# Altium schematic sheet tinyarduinoschematic.SchDoc: Arduino Nanite
size A4; Date: 9/1/2017; DrawnBy: Kartik Deshpande; Engineer: Kartik Deshpande; DocumentNumber: 1; Revision: 1.0; SheetNumber: 1; SheetTotal: 1; DocumentName: Adruino Nanite; ProjectName: Arduino Nanite
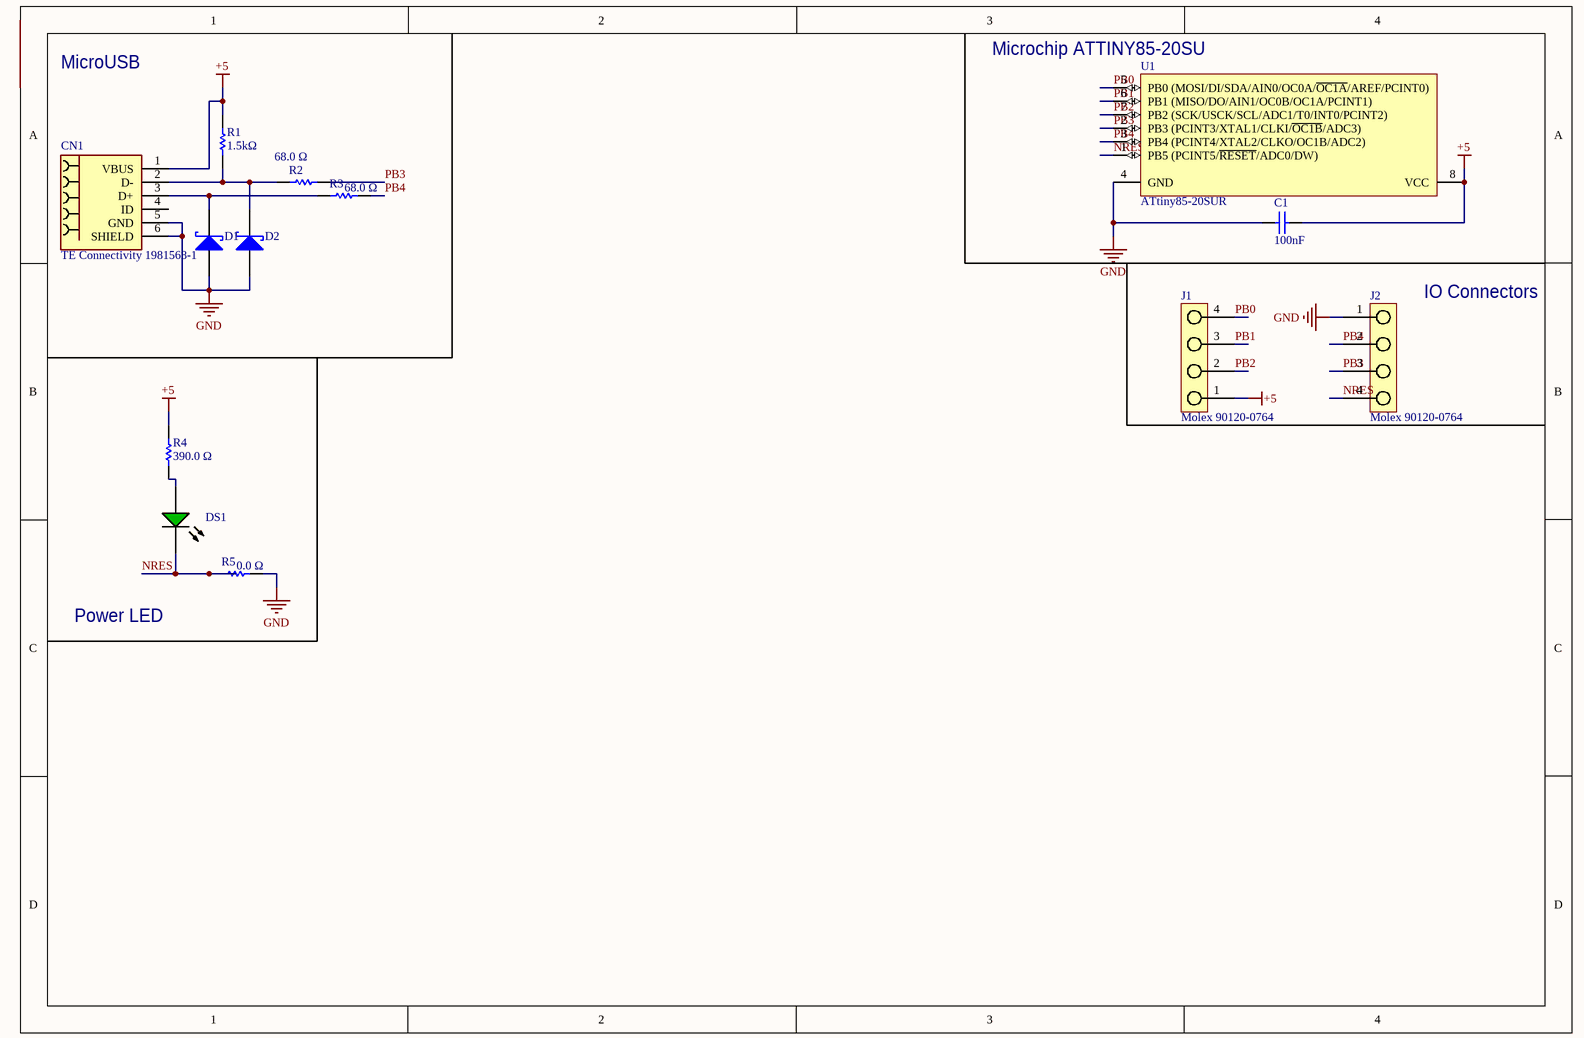
[diagram p0: tinyarduinoschematic.SchDoc]

## Parts
C1  Capacitance: 100nF  [PCB-cpn3sq1sqkb7wcygmy3s-1]  (hidden comment: Cap)
CN1  TE Connectivity 1981568-1  [PCB-flraprbq3lplkrvccqj1-1]
D1  Diodes Inc. B0540WS-7  [PCB-6tqbiewd2diqb4h5r69p-1]  (value not drawn)
D2  Diodes Inc. B0540WS-7  [PCB-6tqbiewd2diqb4h5r69p-1]  (value not drawn)
DS1  Avago HSMG-C190  [AVAG-HSMX-C190]  (value not drawn)
J1  Molex 90120-0764  [PCB-mruwntkvy73mrw75dg9m-1]
J2  Molex 90120-0764  [PCB-mruwntkvy73mrw75dg9m-1]
R1  Resistance: 1.5kΩ  [RESC1609X50X30LL10T20]  (hidden comment: Vishay Dale CRCW06031K50JNEA)
R2  Resistance: 68.0 Ω  [RESC1609X50X30ML10T20]  (hidden comment: Vishay Dale CRCW060368R0JNEA)
R3  Resistance: 68.0 Ω  [RESC1609X50X30ML10T20]  (hidden comment: Vishay Dale CRCW060368R0JNEA)
R4  Resistance: 390.0 Ω  [RESC1609X50X30LL10T20]  (hidden comment: Vishay Dale CRCW0603390RFKEA)
R5  Resistance: 0.0 Ω  [RESC1609X50X30LL10T20]  (hidden comment: Vishay Dale CRCW06030000Z0EB)
U1  ATtiny85-20SUR  [8S2_L]

## Nets
+5: C1.1 CN1.1(VBUS) J1.1 R1.2 R4.2 U1.8(VCC)
GND: C1.2 CN1.5(GND) CN1.6(SHIELD) D1.2(A) D2.2(A) J2.1 R5.2 U1.4(GND)
NRES: DS1.2(K) J2.4 R5.1 U1.1(PB5_(PCINT5/~{RESET}/ADC0/DW))
PB0: J1.4 U1.5(PB0_(MOSI/DI/SDA/AIN0/OC0A/~{OC1A}/AREF/PCINT0))
PB1: J1.3 U1.6(PB1_(MISO/DO/AIN1/OC0B/OC1A/PCINT1))
PB2: J1.2 U1.7(PB2_(SCK/USCK/SCL/ADC1/T0/INT0/PCINT2))
PB3: J2.3 R2.2 U1.2(PB3_(PCINT3/XTAL1/CLKI/~{OC1B}/ADC3))
PB4: J2.2 R3.2 U1.3(PB4_(PCINT4/XTAL2/CLKO/OC1B/ADC2))
NetCN1_2: CN1.2(D-) D2.1(K) R1.1 R2.1
NetCN1_3: CN1.3(D+) D1.1(K) R3.1
NetDS1_1: DS1.1(A) R4.1

Not connected (* = marked no-connect by the designer): CN1 4(ID)

## Notes on the sheet
- MicroUSB
- (near U1) Microchip ATTINY85-20SU
- (near J2) IO Connectors
- Power LED

## Library data of the parts
C1 = CMP-126693-6: CAP CER 0.1UF 25V X7R 0603; Manufacturer Part Number: 06033C104KAT2A; Vendor Part Number: 478-3714-1-ND; Manufacturer: AVX Corporation; Vendor: Digikey; Tolerance: ±10%; Expanded Description: 0.1µF ±10% 25V Ceramic Capacitor X7R 0603 (1608 Metric); Applications: General Purpose; Octopart URL: http://octopart.com/06033c104kat2a-avx-39590598; Family: Ceramic Capacitors; Operating Temperature: -55°C ~ 125°C; Category: Capacitors; Cost: 0.10; Temperature Coefficient: X7R; Thickness (Max): 0.035" (0.90mm); Mounting Type: Surface Mount, MLCC; Package / Case: 0603 (1608 Metric); OctopartID: 9d69563fa2c942ae; HelpURL: http://datasheets.avx.com/X7RDielectric.pdf; Voltage - Rated: 25V
CN1 = CMP-c4780fb744281bbf-1: Conn Micro USB 2.0 Type B RCP 5 POS 0.65mm Solder RA SMD 5 Terminal 1 Port T/R; ELV Compliant: Compliant; Gender: Female; Lead-Free Status: Lead Free; Packaging: Tape & Reel (TR); OctopartID: c4780fb744281bbf; Mounting Style: Surface Mount; Contact Material: Copper Alloy; Housing Color: Black; Housing Material: Thermoplastic; Lifecycle Status: Active; Octopart URL: http://octopart.com/1981568-1-te+connectivity-46507318; Contact Plating: Gold; RoHS: Compliant; Manufacturer Part Number: 1981568-1; Orientation: Horizontal; Flammability Rating: UL 94 V-0
D1 D2 = CMP-992e5020441546e9-1: B0540WS Series 40 V 0.5 A Schottky Barrier Rectifier Surface Mount - SOD-323; Lead-Free Status: Lead Free; Output Current: 500 mA (max); Current Rating: 500 mA; Polarity: Standard; Voltage Rating (DC): 40.0 V; Capacitance: 125 pF; Mounting Style: Surface Mount; Octopart URL: http://octopart.com/b0540ws-7-diodes+inc.-325725; Case/Package: SOD-323; Packaging: Cut Tape (CT), Tape & Reel (TR); RoHS: Compliant; Number of Pins: 2; Manufacturer Part Number: B0540WS-7; Lifecycle Status: Active; REACH SVHC Compliance: No SVHC; OctopartID: 992e5020441546e9
DS1 = CMP-1544977-3: LED 570NM GREEN DIFF 0603 SMD; Power Dissipation: 0.052 W; Luminous Intensity: 0.015 cd; Wavelength: 5.7e-07 m; Lens Type: Diffused; Viewing Angle: 170 °; Forward Voltage: 2.2 V; Lead-Free Status: Lead Free; RoHS: Compliant; Packaging: Cut Tape (CT); Number of Pins: 2; Octopart Url: https://octopart.com/hsmg-c190-avago-550880; REACH SVHC Compliance: No SVHC; Lifecycle Status: Active; Case/Package: 0603; OctopartID: c0b709b582311f70; Peak Wavelength: 5.7e-07 m; Color: Green
J1 J2 = 90120-0764: 2.54mm (.100") Pitch C-Grid III Header, Single Row, Vertical, 3 Circuits, 0.38µm (15µ") Gold (Au) Selective Plating; Number of Contacts: 4; Current Rating: 3.00 A; Contact Resistance: 20.0 mΩ; Number of Circuits: 3; Gender: Male; Insulation Resistance: 5.00 GΩ; Lead-Free Status: Lead Free; Voltage Rating (DC): 350 V; Glow Wire Compliant: Non-Compliant; Contact Material: Copper; Mounting Style: Through Hole, Vertical; Octopart URL: http://octopart.com/90120-0764-molex-655426; RoHS: Compliant; Material: Polyester; Packaging: Bag; Manufacturer Part Number: 90120-0764; Voltage Rating (AC): 350 V; Size-Width: 2.54 mm; Pin Pitch: 2.54 mm; Housing Material: Plastic; Size-Height: 2.50 mm; Number of Positions: 4; Number of Rows: 1; Housing Color: Black; OctopartID: f5c93cc9d0ed2a0e; Lifecycle Status: Not Listed by Manufacturer; Orientation: Vertical; Halogen Free Status: Not Halogen Free; Size-Length: 10.2 mm; Contact Plating: Gold
R1 = CMP-1856103-2: RES SMD 1.5K OHM 5% 1/10W 0603; Lead-Free Status: Lead Free; Power Rating: 0.1 W; Temperature Coefficient: 200.0 ppm/°C; Voltage Rating (DC): 75.0 V; Case/Package: 0603; Mounting Style: Surface Mount; Number of Pins: 2; Octopart Url: https://octopart.com/crcw06031k50jnea-vishay-39435173; OctopartID: 26f3eda0b830f934; Packaging: Cut Tape (CT); Resistance Tolerance: ±5%; RoHS: Compliant; Size-Height: 0.00045 m; Size-Length: 0.00155 m; Size-Width: 0.00085 m
R2 R3 = CMP-1866767-2: RES SMD 68 OHM 5% 1/10W 0603; Lead-Free Status: Lead Free; Power Rating: 0.1 W; Temperature Coefficient: 200.0 ppm/°C; Voltage Rating (DC): 75.0 V; Case/Package: 0603; Mounting Style: Surface Mount; Number of Pins: 2; Octopart Url: https://octopart.com/crcw060368r0jnea-vishay+dale-39825490; OctopartID: 7ef2b5a7ebc6a135; Resistance Tolerance: ±5%; RoHS: Compliant; Size-Height: 0.00045 m; Size-Length: 0.00155 m; Size-Width: 0.00085 m
R4 = CMP-3855866-2: RES SMD 390 OHM 1% 1/10W 0603; Lead-Free Status: Lead Free; Power Rating: 0.1 W; Voltage Rating (DC): 75.0 V; Case/Package: 0603; Mounting Style: Surface Mount; Number of Pins: 2; Octopart Url: https://octopart.com/crcw0603390rfkea-vishay-39804292; OctopartID: 4cdb878e3439931c; REACH SVHC Compliance: No SVHC; Resistance Tolerance: ±1%; RoHS: Compliant; Size-Height: 0.00045 m; Size-Length: 0.00155 m; Size-Width: 0.00085 m
R5 = CMP-1906891-2: Thick Film Resistors - SMD 1/10watt ZEROohm Jumper; Lead-Free Status: Lead Free; Power Rating: 0.1 W; Voltage Rating (DC): 75.0 V; Case/Package: 0603; Number of Pins: 2; Octopart Url: https://octopart.com/crcw06030000z0eb-vishay-42505985; OctopartID: 61d7aa55d3b0be10; Packaging: Cut Tape (CT); RoHS: Compliant; Size-Length: 0.00155 m; Size-Width: 0.00085 m
U1 = ATTINY85-20SUR: 8-bit AVR Microcontroller, 20MHz, 2.7-5.5V, 8K Flash, 512 Bytes EEPROM, 512 Bytes SRAM, Industrial Grade (-40°C to 85°C), 8-Lead SOIC, Pb-Free, Reel; Lead-Free Status: Lead Free; Octopart Url: https://octopart.com/attiny85-20sur-atmel-18611788; OctopartID: 8991418052bb5656; RoHS: Compliant